# Altium schematic sheet SwiftCtrl.SchDoc
size 292 x 193 mm; Author: Power Lin; DocumentNumber: 1; SheetNumber: 1; SheetTotal: 4; Website: wiki-power.com
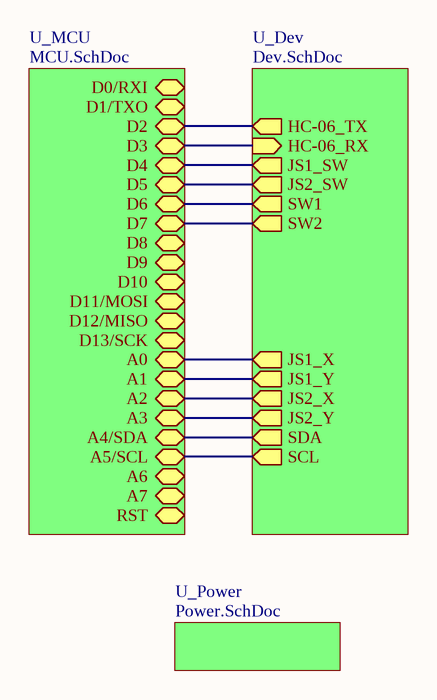
[diagram p0: SwiftCtrl.SchDoc]

## Sub-sheets
U_Dev = Dev.SchDoc: JS1_SW (out), JS1_Y (out), JS1_X (out), JS2_SW (out), JS2_Y (out), JS2_X (out), SDA (out), SCL (out), HC-06_TX (out), HC-06_RX (in), SW1 (out), SW2 (out)
U_MCU = MCU.SchDoc: D2 (bidir), D3 (bidir), D4 (bidir), D5 (bidir), D6 (bidir), D7 (bidir), A6 (bidir), A7 (bidir), D8 (bidir), D9 (bidir), D12/MISO (bidir), D10 (bidir), D11/MOSI (bidir), A0 (bidir), A1 (bidir), A4/SDA (bidir), A5/SCL (bidir), A2 (bidir), A3 (bidir), D13/SCK (bidir), RST (bidir), D0/RXI (bidir), D1/TXO (bidir)
U_Power = Power.SchDoc: no entries

## Nets
(unnamed): sheet U_Dev/JS1_SW, sheet U_MCU/D4
(unnamed): sheet U_Dev/JS1_Y, sheet U_MCU/A1
(unnamed): sheet U_Dev/JS1_X, sheet U_MCU/A0
(unnamed): sheet U_Dev/JS2_SW, sheet U_MCU/D5
(unnamed): sheet U_Dev/JS2_Y, sheet U_MCU/A3
(unnamed): sheet U_Dev/JS2_X, sheet U_MCU/A2
(unnamed): sheet U_Dev/SDA, sheet U_MCU/A4/SDA
(unnamed): sheet U_Dev/SCL, sheet U_MCU/A5/SCL
(unnamed): sheet U_Dev/HC-06_TX, sheet U_MCU/D2
(unnamed): sheet U_Dev/HC-06_RX, sheet U_MCU/D3
(unnamed): sheet U_Dev/SW1, sheet U_MCU/D6
(unnamed): sheet U_Dev/SW2, sheet U_MCU/D7

## Notes on the sheet
- Author
- DocumentName
- ModifiedDate
- ProjectName
- SheetNumber
- SheetTotal
- Website
- Revision